# Altium schematic sheet StlinkV2.SchDoc
size A4; SheetNumber: 2; SheetTotal: 3
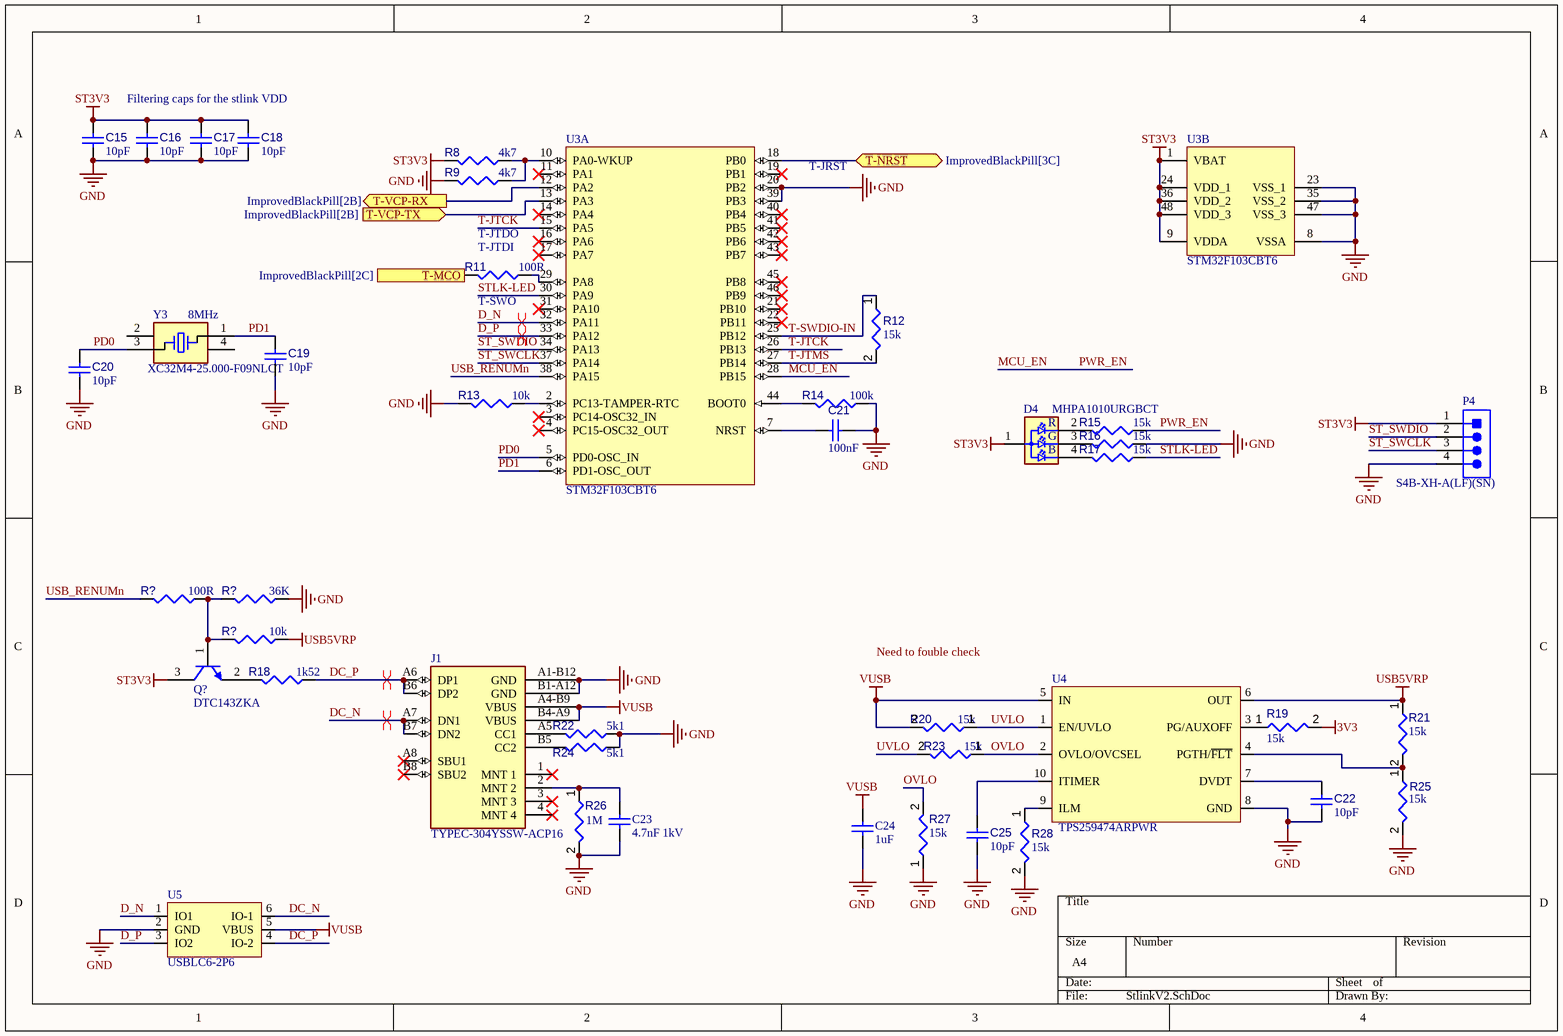
[diagram p0: StlinkV2.SchDoc]

## Parts
(Parts that share a designator on the sheet are numbered #1, #2 ... from top to bottom, then left to right.)
C15  value 10pF  [CAPC1005X55X25ML05T05]  (hidden comment: Capacitor 10 pF +/- 5% 50 V 0402)
C16  value 10pF  [CAPC1005X55X25ML05T05]  (hidden comment: Capacitor 10 pF +/- 5% 50 V 0402)
C17  value 10pF  [CAPC1005X55X25ML05T05]  (hidden comment: Capacitor 10 pF +/- 5% 50 V 0402)
C18  value 10pF  [CAPC1005X55X25ML05T05]  (hidden comment: Capacitor 10 pF +/- 5% 50 V 0402)
C19  value 10pF  [CAPC1005X55X25ML05T05]  (hidden comment: Capacitor 10 pF +/- 5% 50 V 0402)
C20  value 10pF  [CAPC1005X55X25ML05T05]  (hidden comment: Capacitor 10 pF +/- 5% 50 V 0402)
C21  value 100nF  [CAPC1005X55X25ML05T05]  (hidden comment: Capacitor 10 pF +/- 5% 50 V 0402)
C22  value 10pF  [CAPC1005X55X25ML05T05]  (hidden comment: Capacitor 10 pF +/- 5% 50 V 0402)
C23  4.7nF 1kV  [CAPC2013X135X50ML15T20]
C24  1uF  [CAPC2013X135X50ML15T20]
C25  value 10pF  [CAPC1005X55X25ML05T05]  (hidden comment: Capacitor 10 pF +/- 5% 50 V 0402)
D4  MHPA1010URGBCT  [FP-SML-LX0404SIUPGUSB-MFG]
J1  TYPEC-304YSSW-ACP16  [FP-USB4110-GF-A-MFG]
P4  S4B-XH-A(LF)(SN)  [JST-S4B-XH-A(LF)(SN)_V]
Q?  DTC143ZKA  [ONSC-SOT-23-3-318-08_V]
R8  value 4k7  [RESC1005X40X25ML10T10]  (hidden comment: Resistor 15k +/-1% 0402 63 mW)
R9  value 4k7  [RESC1005X40X25ML10T10]  (hidden comment: Resistor 15k +/-1% 0402 63 mW)
R11  value 100R  [RESC1005X40X25ML10T10]  (hidden comment: Resistor 15k +/-1% 0402 63 mW)
R12  value 15k  [RESC1005X40X25ML10T10]  (hidden comment: Resistor 15k +/-1% 0402 63 mW)
R13  value 10k  [RESC1005X40X25ML10T10]  (hidden comment: Resistor 15k +/-1% 0402 63 mW)
R14  value 100k  [RESC1005X40X25ML10T10]  (hidden comment: Resistor 15k +/-1% 0402 63 mW)
R15  value 15k  [RESC1005X40X25ML10T10]  (hidden comment: Resistor 15k +/-1% 0402 63 mW)
R16  value 15k  [RESC1005X40X25ML10T10]  (hidden comment: Resistor 15k +/-1% 0402 63 mW)
R17  value 15k  [RESC1005X40X25ML10T10]  (hidden comment: Resistor 15k +/-1% 0402 63 mW)
R18  value 1k52  [RESC1005X40X25ML10T10]  (hidden comment: Resistor 15k +/-1% 0402 63 mW)
R19  value 15k  [RESC1005X40X25ML10T10]  (hidden comment: Resistor 15k +/-1% 0402 63 mW)
R20  value 15k  [RESC1005X40X25ML10T10]  (hidden comment: Resistor 15k +/-1% 0402 63 mW)
R21  value 15k  [RESC1005X40X25ML10T10]  (hidden comment: Resistor 15k +/-1% 0402 63 mW)
R22  value 5k1  [RESC1005X40X25ML10T10]  (hidden comment: Resistor 15k +/-1% 0402 63 mW)
R23  value 15k  [RESC1005X40X25ML10T10]  (hidden comment: Resistor 15k +/-1% 0402 63 mW)
R24  value 5k1  [RESC1005X40X25ML10T10]  (hidden comment: Resistor 15k +/-1% 0402 63 mW)
R25  value 15k  [RESC1005X40X25ML10T10]  (hidden comment: Resistor 15k +/-1% 0402 63 mW)
R26  value 1M  [RESC1005X40X25ML10T10]  (hidden comment: Resistor 15k +/-1% 0402 63 mW)
R27  value 15k  [RESC1005X40X25ML10T10]  (hidden comment: Resistor 15k +/-1% 0402 63 mW)
R28  value 15k  [RESC1005X40X25ML10T10]  (hidden comment: Resistor 15k +/-1% 0402 63 mW)
R?#1  value 100R  [RESC1005X40X25ML10T10]  (hidden comment: Resistor 15k +/-1% 0402 63 mW)
R?#2  value 36K  [RESC1005X40X25ML10T10]  (hidden comment: Resistor 15k +/-1% 0402 63 mW)
R?#3  value 10k  [RESC1005X40X25ML10T10]  (hidden comment: Resistor 15k +/-1% 0402 63 mW)
U3  STM32F103CBT6  [STM-LQFP48_M]  (parts A,B of 2)
U4  TPS259474ARPWR  [VQFN-HR-10]
U5  USBLC6-2P6  [FP-SOT-666-MFG]
Y3  XC32M4-25.000-F09NLCT  [830105863709]

## Ports
T-MCO (out, see ImprovedBlackPill[2C]), T-NRST (bidir, see ImprovedBlackPill[3C]), T-VCP-RX (out, see ImprovedBlackPill[2B]), T-VCP-TX (in, see ImprovedBlackPill[2B])

## Nets
3V3: R19.2
GND: C15.1 C16.1 C17.1 C18.1 C19.1 C20.1 C21.1 C22.1 C23.2 C24.2 C25.1 J1.A1-B12(GND) J1.B1-A12(GND) P4.4 R9.2 R13.2 R14.1 R16.1 R22.1 R24.1 R25.2 R26.2 R27.1 R28.2 R?#2.1 U3.8(VSSA) U3.20(PB2) U3.23(VSS_1) U3.35(VSS_2) U3.39(PB3) U3.47(VSS_3) U4.8(GND) U5.2(GND)
ST3V3: C15.2 C16.2 C17.2 C18.2 D4.1(Common_Anode) P4.1 Q?.3(C) R8.2 U3.1(VBAT) U3.9(VDDA) U3.24(VDD_1) U3.36(VDD_2) U3.48(VDD_3)
USB5VRP: R21.1 R?#3.1 U4.6(OUT)
VUSB: C24.1 J1.A4-B9(VBUS) J1.B4-A9(VBUS) R20.2 U4.5(IN) U5.5(VBUS)
D_N: U3.32(PA11) U5.1(IO1)
D_P: U3.33(PA12) U5.3(IO2)
DC_N: J1.A7(DN1) J1.B7(DN2) U5.6(IO-1)
DC_P: J1.A6(DP1) J1.B6(DP2) R18.1 U5.4(IO-2)
MCU_EN: R15.1 U3.28(PB15)  [also labelled PWR_EN]
OVLO: R23.1 R27.2 U4.2(OVLO/OVCSEL)
PD0: C20.2 U3.5(PD0-OSC_IN) Y3.3(CRYSTAL__2)
PD1: C19.2 U3.6(PD1-OSC_OUT) Y3.1(CRYSTAL__1)
ST_SWCLK: P4.3 U3.37(PA14)
ST_SWDIO: P4.2 U3.34(PA13)
STLK-LED: R17.1 U3.30(PA9)
T-JTCK: U3.15(PA5) U3.26(PB13)
T-JTMS: R12.2 U3.27(PB14)
T-MCO: R11.2 ; port T-MCO
T-NRST: U3.18(PB0) ; port T-NRST
T-SWDIO-IN: R12.1 U3.25(PB12)
T-VCP-RX: U3.12(PA2) ; port T-VCP-RX
T-VCP-TX: U3.13(PA3) ; port T-VCP-TX
USB_RENUMn: R?#1.2 U3.38(PA15)
UVLO: R20.1 R23.2 U4.1(EN/UVLO)
NetC21_2: C21.2 U3.7(NRST)
NetC22_2: C22.2 U4.7(DVDT)
NetC23_1: C23.1 J1.2(MNT_2) R26.1
NetC25_2: C25.2 U4.10(ITIMER)
NetD4_2: D4.2(Red_C) R15.2
NetD4_3: D4.3(Blue_C) R16.2
NetD4_4: D4.4(B) R17.2
NetJ1_A5: J1.A5(CC1) R22.2
NetJ1_B5: J1.B5(CC2) R24.2
NetQ?_1: Q?.1(B) R?#1.1 R?#2.2 R?#3.2
NetQ?_2: Q?.2(E) R18.2
NetR8_1: R8.1 R9.1 U3.10(PA0-WKUP)
NetR11_1: R11.1 U3.29(PA8)
NetR13_1: R13.1 U3.2(PC13-TAMPER-RTC)
NetR14_2: R14.2 U3.44(BOOT0)
NetR19_1: R19.1 U4.3(PG/AUXOFF)
NetR21_2: R21.2 R25.1 U4.4(PGTH/~{FLT})
NetR28_1: R28.1 U4.9(ILM)

Not connected (* = marked no-connect by the designer): J1 1(MNT_1)* 3(MNT_3)* 4(MNT_4)* A8(SBU1)* B8(SBU2)*; U3 3(PC14-OSC32_IN)* 4(PC15-OSC32_OUT)* 11(PA1)* 14(PA4)* 16(PA6)* 17(PA7)* 19(PB1)* 21(PB10)* 22(PB11)* 31(PA10)* 40(PB4)* 41(PB5)* 42(PB6)* 43(PB7)* 45(PB8)* 46(PB9)*; Y3 2(GND_&_LID_1) 4(GND_&_LID_2)

## Layout directives
differential pair: D_N, D_P, DC_N, DC_P

## Notes on the sheet
- Filtering caps for the stlink VDD
- T-JRST
- (near R11) T-JTDI
- T-JTDO
- (near R11) T-SWO
- (near Y3) 8MHz
- Labels drawn without touching a wire or pin: Need to fouble check
- (in symbol CMP-007-00037-2) R; G

## Library data of the parts
C15-C22 C25 = CMP-001-00013-7: Chip Capacitor, 10 pF, +/- 5%, 50 V, 0402 (1005 Metric); Capacitor Type: Ceramic; Voltage Rating: 50V; Max Operating Temperature: 125°C; Pins: 2; Mounting Technology: SM; Tolerance: 5%; RoHS Compliant: True; Case/Package: 0402; Min Operating Temperature: -55°C
C23 C24 = CMP-2265601-2: CAP CER 10000PF 50V 10% X7R 0805; Manufacturer Part Number: VJ0805Y103KXACW1BC; Capacitance: 1e-08 F; Case/Package (SI): 2012; Dielectric Material: Tantalum; Lead-Free Status: Lead Free; Voltage Rating (DC): 50.0 V; Capacitance Tolerance: ±10%; Case/Package: 0805; Dielectric Characteristic: X7R; Mounting Style: Surface Mount; Number of Pins: 2; Octopart Url: https://octopart.com/vj0805y103kxacw1bc-vishay-39476146; OctopartID: 26e2edb25836f925; Packaging: Tape; RoHS: Compliant; Size-Height: 0.000925 m; Size-Length: 0.002 m; Size-Width: 0.00125 m
D4 = CMP-007-00037-2
J1 = CMP-002-00169-4: 5A USB 3.1 1 260℃ Horizontal attachment 16P Female -25℃~+85℃ Type-C SMD USB Connectors ROHS
P4 = CMP-002-00034-2: Male Header, Pitch 2.5 mm, 1 x 4 Position, Height 6.1 mm, Tail Length 3.4 mm, -25 to 85 degC, RoHS, Bulk; Manufacturer: JST; Manufacturer URL: http://www.jst.com/home2.html; RoHS Compliant: Unknown; Gender: Male; Min Operating Temperature: -25°C; Datasheet URL: http://www.jst-mfg.com/product/pdf/eng/eXH.pdf; Case/Package: S4B-XH-A(LF)(SN); Datasheet Version: May-16; Mounting Technology: TH; Package Reference: S4B-XH-A(LF)(SN); Max Operating Temperature: 85°C; Package Description: XH Series Disconnectable Crimp Style Connector, Pitch 2.5 mm, 1 x 4 Position, Height 6.1 mm, Tail Length 3.4 mm; Connector Type: Header
Q? = CMP-013-00007-3: General Purpose Transistor, NPN Silicon, 40 V, 0.2 A, -55 to 150 degC, 3-Pin SOT23, RoHS, Tape and Reel; Manufacturer: ON Semiconductor; Elements: 1; Power: 225mW; Frequency: 300MHz; hFE Min: 80; Vce Max: 300mV; Mounting Technology: SM; Min Operating Temperature: -55°C; Datasheet URL: http://www.onsemi.cn/pub_link/Collateral/MMBT3904LT1-D.PDF; Pins: 3; Package Description: 3-Pin Small Outline Transistor, Body 2.9 x 1.3 mm, Pitch 0.95 mm; Max Operating Temperature: 150°C; Package Reference: SOT-23 (318-08); Package Quantity: 3000; RoHS Compliant: True; Packaging: TapeandReel; Datasheet Version: Rev. 12, 11/2012; Case/Package: TO-236-3
R8 R9 R11-R28 R?#1-R?#3 = CMP-009-00026-5: Chip Resistor, 15 KOhm, +/- 1%, 0.063 W, -55 to 155 degC, 0402 (1005 Metric); Power: 63mW; Min Operating Temperature: -55°C; Tolerance: 1%; Max Operating Temperature: 155°C; Mounting Technology: SM; Case/Package: 0402; RoHS Compliant: True; Pins: 2
U3 = CMP-020-00024-1: RISC Microcontroller, 32-Bit, FLASH, CORTEX-M3 CPU, 72MHz, CMOS, PQFP48; Max Supply Voltage: 3.6V; Clock Frequency: 16MHz; Min Supply Voltage: 2V; Nominal Supply Voltage: 3.3V; Min Operating Temperature: -40°C; Case/Package: LFQFP; Max Operating Temperature: 105°C; RoHS Compliant: Yes; Pins: 48
U4 = CMP-030-000087-2: 2.7-V–23-V, 5.5-A, 28-mΩ True Reverse Current Blocking eFuse with / Input Reverse Polarity Protection; Manufacturer: Texas Instruments; Design Item ID: TPS259472ARPWR; Manufacturer Part Number: TPS259472ARPWR; Source: Schematic-Lib-PhilsLab.SchLib
U5 = CMP-004-00070-1: Trans Voltage Suppressor Diode, 5V V(RWM), Unidirectional, 1 Element, Silicon; Min Operating Temperature: -40°C; RoHS Compliant: Yes; Pins: 6; Max Operating Temperature: 125°C
Y3 = CMP-003-000311-1: Load Capacitance: 9pF; Frequency: 25MHz; Case/Package: 3.2 x 2.5mm